# EAGLE design xkid_0.4 (EAGLE 7.1.0)
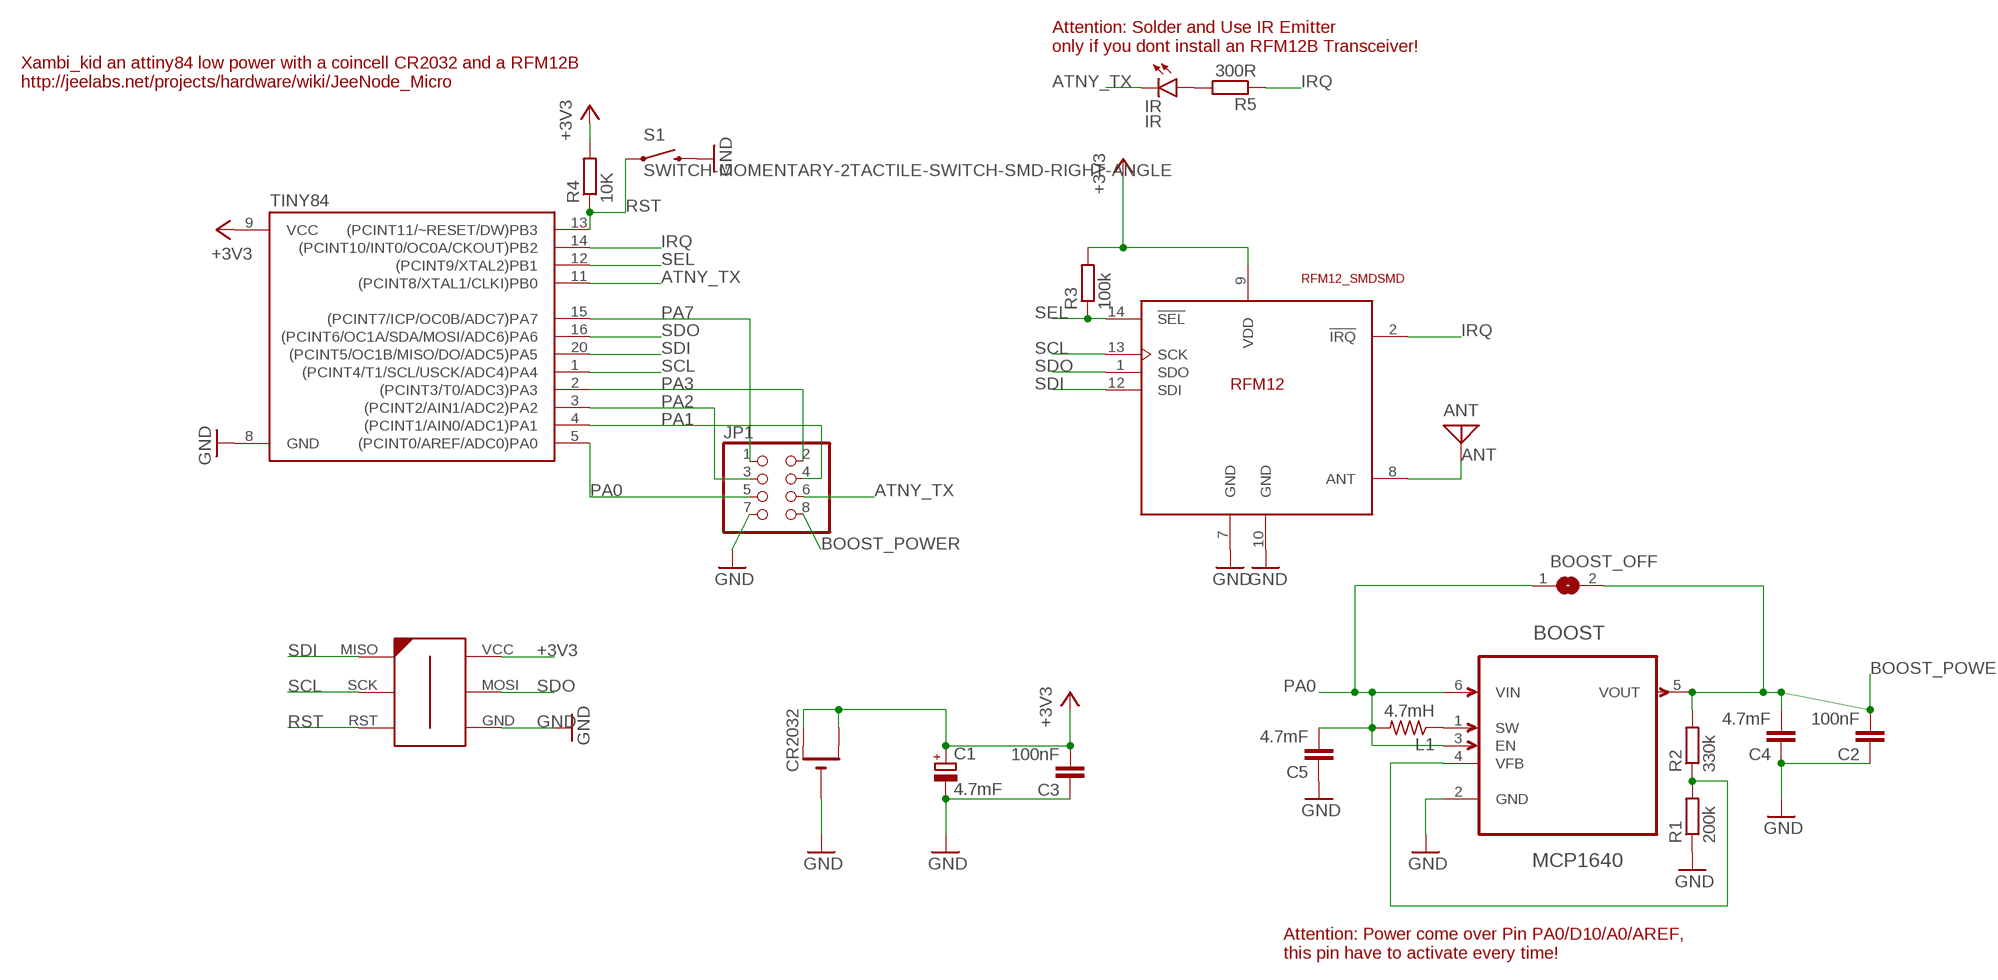
[diagram p0: schematic, sheet 1]

## Parts
ANT  ANTENNA  [PAD-01]
BOOST  MCP1640  MCP1640BT-I/CHY  [SOT95P270X145-6N]
BOOST_OFF  SJ  [SJ]
C1  4.7mF  CPOL-EUCT3216  [CT3216]
C2  100nF  C-EUC0805K  [C0805K]
C3  100nF  C-EUC0805K  [C0805K]
C4  4.7mF  C-EUC0805K  [C0805K]
C5  4.7mF  C-EUC0805K  [C0805K]
CR2032  CR2032SMT  [CR2032-SMD]
IR  IR  LED3MM  [LED3MM]
JP1  PINHD-2X4_2.54  [2X04]
L1  4.7mH  R-US_0204/5  [0204/5]
R1  200k  R-EU_R0805  [R0805]
R2  330k  R-EU_R0805  [R0805]
R3  100k  R-EU_R0805  [R0805]
R4  10K  R-EU_R0805  [R0805]
R5  300R  R-EU_R0805  [R0805]
S1  SWITCH-MOMENTARY-2TACTILE-SWITCH-SMD-RIGHT-ANGLE  [TACTILE_SWITCH-SMD-RIGHT-ANGLE]
TINY84  ATTINY84ATTINY84-20MU  [QFN20]
U$1  RFM12_SMDSMD  [RFM12]
U$2  AVR-ISP-6-EDGE  [6PAD_ISP]

## Nets
+3V3: C1.+ C3.2 CR2032.+$1(+) CR2032.+$2(+1) R3.2 R4.2 TINY84.9(VCC) U$1.9(VDD) U$2.VCC
ANT: ANT.1 U$1.8(ANT)
ATNY_TX: IR.K(C) JP1.6 TINY84.11((PCINT8/XTAL1/CLKI)PB0)
BOOST_POWER: BOOST.5(VOUT) BOOST_OFF.2 C2.2 C4.2 JP1.8 R2.2
GND: BOOST.2(GND) C1.- C2.1 C3.1 C4.1 C5.1 CR2032.- JP1.7 R1.1 S1.2 TINY84.8(GND) U$1.7(GND) U$1.10(GND) U$2.GND
IRQ: R5.1 TINY84.14((PCINT10/INT0/OC0A/CKOUT)PB2) U$1.2(!IRQ)
N$1: IR.A R5.2
N$2: BOOST.1(SW) L1.1
N$4: BOOST.4(VFB) R1.2 R2.1
PA0: BOOST.3(EN) BOOST.6(VIN) BOOST_OFF.1 C5.2 JP1.5 L1.2 TINY84.5((PCINT0/AREF/ADC0)PA0)
PA1: JP1.4 TINY84.4((PCINT1/AIN0/ADC1)PA1)
PA2: JP1.3 TINY84.3((PCINT2/AIN1/ADC2)PA2)
PA3: JP1.2 TINY84.2((PCINT3/T0/ADC3)PA3)
PA7: JP1.1 TINY84.15((PCINT7/ICP/OC0B/ADC7)PA7)
RST: R4.1 S1.1 TINY84.13((PCINT11/~RESET/DW)PB3) U$2.RST
SCL: TINY84.1((PCINT4/T1/SCL/USCK/ADC4)PA4) U$1.13(SCK) U$2.SCK
SDI: TINY84.20((PCINT5/OC1B/MISO/DO/ADC5)PA5) U$1.12(SDI) U$2.MISO
SDO: TINY84.16((PCINT6/OC1A/SDA/MOSI/ADC6)PA6) U$1.1(SDO) U$2.MOSI
SEL: R3.1 TINY84.12((PCINT9/XTAL2)PB1) U$1.14(!SEL)

## Notes on the sheet
- Attention: Solder and Use IR Emitter 
  only if you dont install an RFM12B Transceiver!
- Xambi_kid an attiny84 low power with a coincell CR2032 and a RFM12B
  http://jeelabs.net/projects/hardware/wiki/JeeNode_Micro
- Attention: Power come over Pin PA0/D10/A0/AREF,
  this pin have to activate every time!

## Library data of the parts
ANT = discrete:ANTENNA: Antenna
BOOST = xpix:MCP1640BT-I/CHY: Synchronous Boost Regulator; MPN: MCP1640BT-I/CHY; OC_FARNELL: 1800207; OC_NEWARK: 73R3625; PACKAGE: SOT-6; SUPPLIER: Microchip
BOOST_OFF = jumper:SJ: SMD solder JUMPER
C1 = rcl:CPOL-EU: POLARIZED CAPACITOR, European symbol
C2-C5 = rcl:C-EU: CAPACITOR, European symbol
CR2032 = adafruit:CR2032
IR = SparkFun-LED:LED: LEDs Standard schematic elements and footprints for 5mm, 3mm, 1206, and 0603 sized LEDs. 5mm - Spark Fun Electronics SKU : COM-00529 (and others)
JP1 = pinhead:PINHD-2X4: PIN HEADER
L1 = _adafruit:R-US_: RESISTOR, American symbol
R1-R5 = rcl:R-EU_: RESISTOR, European symbol
S1 = SparkFun-Electromechanical:SWITCH-MOMENTARY-2: Various NO switches- pushbuttons, reed, etc; PROD_ID: COMP-12265
TINY84 = SparkFun-DigitalIC:ATTINY84: Atmel 14-pin 2/4/8kB flash uC
U$1 = rfm_12:RFM12_SMD: RFM12 is a low costing ISM band transceiver module implemented with unique PLL. It works signal ranges from 315/433/868/915MHZ bands, comply with FCC, ETSI regulation. The SPI interface is used to communicate with microcontroller for parameter setting.
U$2 = avr-7:AVR-ISP-6-EDGE: 6 pin edge connector for ISP with ATMEL MCUs. Developed by Craig Moates (craig at moates dot net). Library by David Blundell (blundar at gmail dot com). Often, even a 6 pin header is really inconvenient for board layout and/or production. This SMD-only header is our de-facto standard for using an edge connector for programming with the help of a 6pin/10pin to edge card adapter.

## Board
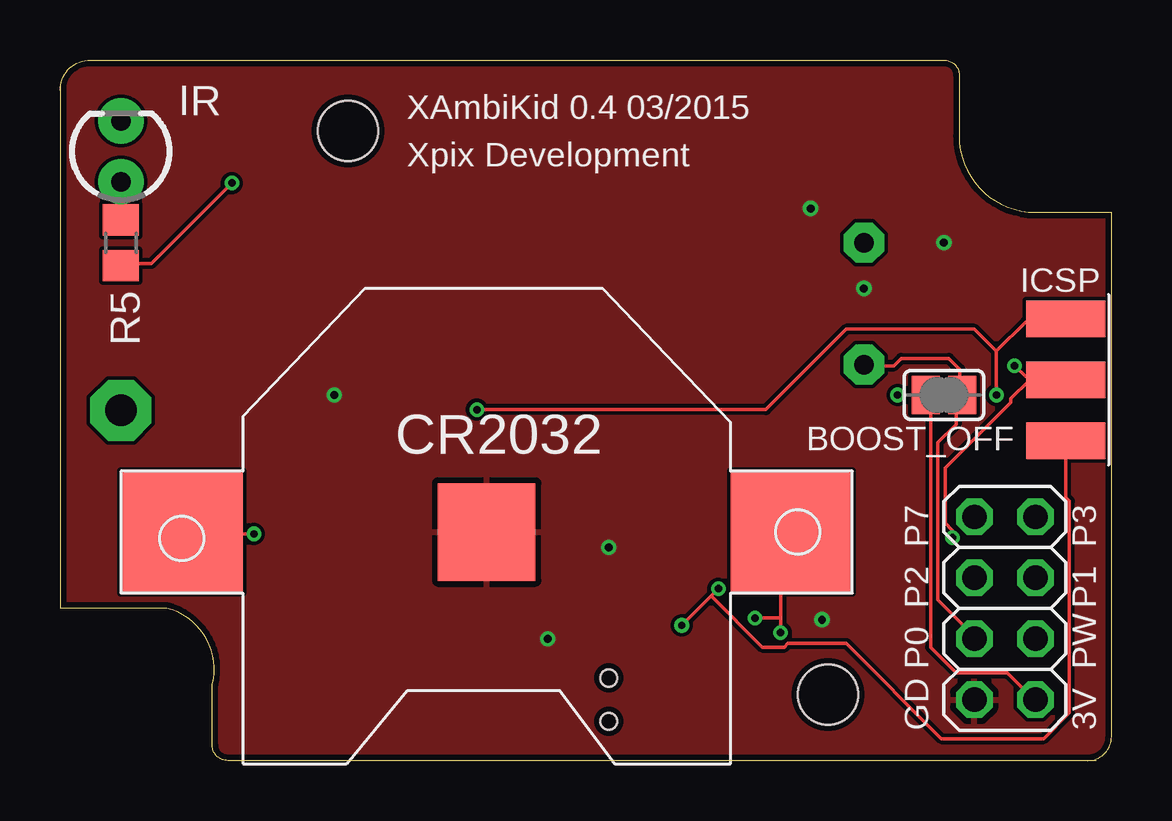
[diagram p1: board, top side]
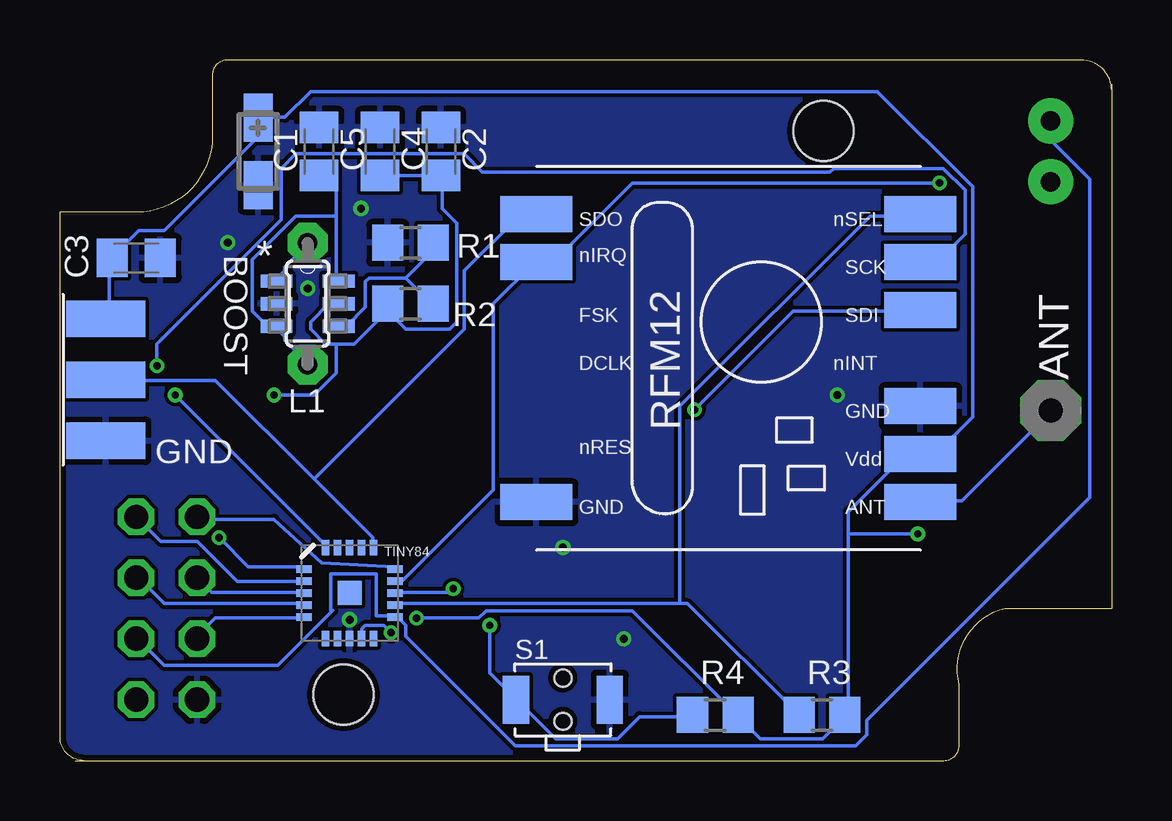
[diagram p2: board, bottom side, seen from below]

Size 43.81 x 29.21 mm. Coordinates in mm from the lower left corner, seen from the top.
Outline: 42.81,0 arc90 43.81,1 43.81,22.86 40.64,22.86 arc-90 37.47,26.04 37.47,28.57 arc90 36.83,29.21 1.27,29.21 arc90 0,27.94
Outline: 0,28.21 0,6.35 4.45,6.35 arc-90 6.35,3.17 6.35,0.64 arc90 6.99,0 43.18,0
Copper layers (1*16): Top 0.035mm / dielectric 1.5mm / Bottom 0.035mm
Design rules "ITEADstudio_DRC": minimum track width 6mil, minimum drill 12mil, track to track 6mil, track to pad 6mil, pad to pad 6mil, via to via 6mil, smd to smd 0mil, copper to edge 10mil, drill to drill 10mil, minimum pad ring 10mil, minimum via ring 6mil, stop-mask expansion 2mil, vias tented up to drill 100mil, thermal gap 10mil
Holes 2.5 mm at 32,2.75 12,26.25

### Footprints (pad centres in the part's own frame; a part is rotated, then mirrored left to right if it is on the bottom)
PAD-01 = drill 1.321 pad 2.54 octagon: 1 0,0
SOT95P270X145-6N = smd 1.321 x 0.559: 1 -1.295,0.94; 2 -1.295,0; 3 -1.295,-0.94; 4 1.295,-0.94; 5 1.295,0; 6 1.295,0.94
SJ = smd 1.168 x 1.6: 1 -0.762,0; 2 0.762,0
CT3216 = smd 2 x 1.2: + -1.4,0; - 1.4,0
C0805K = smd 1.3 x 1.6: 1 -1,0; 2 1,0
CR2032-SMD = smd 5.08 x 5.08: +$1 -12.7,0; +$2 12.7,0 | smd 4.064 x 4.064: - 0,0
LED3MM = drill 0.813 pad 1.88: A -1.27,0; K 1.27,0
2X04 = drill 1.016 octagon: 1 -3.81,-1.27; 2 -3.81,1.27; 3 -1.27,-1.27; 4 -1.27,1.27; 5 1.27,-1.27; 6 1.27,1.27; 7 3.81,-1.27; 8 3.81,1.27
0204/5 = drill 0.813 pad 1.676 octagon: 1 -2.54,0; 2 2.54,0
R0805 = smd 1.3 x 1.5: 1 -0.95,0; 2 0.95,0
TACTILE_SWITCH-SMD-RIGHT-ANGLE = smd 1.1 x 2: 1 -1.95,0; 2 1.95,0 | hole 0.7: 0,0.9; 0,-0.9
QFN20 = smd 1 x 1: 0 0,0 | smd 0.65 x 0.3: 1 -1.9,1; 2 -1.9,0.5; 3 -1.9,0; 4 -1.9,-0.5; 5 -1.9,-1; 11 1.9,-1; 12 1.9,-0.5; 13 1.9,0; 14 1.9,0.5; 15 1.9,1 | smd 0.3 x 0.65: 6 -1,-1.9; 7 -0.5,-1.9; 8 0,-1.9; 9 0.5,-1.9; 10 1,-1.9; 16 1,1.9; 17 0.5,1.9; 18 0,1.9; 19 -0.5,1.9; 20 -1,1.9
RFM12 = smd 1.5 x 3: 1 -5,-10; 2 -3,-10; 7 7,-10; 8 7,6; 9 5,6; 10 3,6; 12 -1,6; 13 -3,6; 14 -5,6
6PAD_ISP = smd 1.524 x 3.302 bottom: GND 2.54,0; MOSI 0,0; VCC -2.54,0 | smd 1.524 x 3.302: MISO -2.54,0; RST 2.54,0; SCK 0,0

### Placement (x,y rotation side)
ANT  2.54,14.61 270 bottom
BOOST  33.5,19.05 0 bottom
BOOST_OFF  36.83,15.24 180 top
C1  35.56,25.4 270 bottom
C2  27.94,25.4 270 bottom
C3  40.64,20.95 180 bottom
C4  30.48,25.4 270 bottom
C5  33.02,25.4 270 bottom
CR2032  17.78,9.53 180 top
IR  2.54,25.4 90 top
JP1  39.37,6.35 270 top
L1  33.5,19.05 270 bottom
R1  29.21,21.59 0 bottom
R2  29.21,19.05 180 bottom
R3  12.06,1.91 0 bottom
R4  16.51,1.91 0 bottom
R5  2.54,21.59 90 top
S1  22.86,2.54 0 bottom
TINY84  31.75,6.99 0 bottom
U$1  13.97,17.78 270 bottom
U$2  41.91,15.88 270 top

### Tracks (layer width: path | path; a pad name or v marks a point on that pad's centre or on a via)
+3V3  (via drill 0.3)
  Top 0.152: 30.02,5.94 30.02,8.99 30.48,9.45 CR2032.+$1 | 30.02,5.94 v30.02,5.33 | v8.08,9.45 5.18,9.45 CR2032.+$2 | v28.96,5.94 30.02,5.94
  Bottom 0.152: U$2.VCC 41.91,18.44 41.76,18.59 41.76,20.88 C3.2 41.6,21.03 40.54,22.1 39.47,22.1 35.66,25.91 35.66,26.67 C1.+ 35.51,26.82 34.44,26.82 33.38,27.89 9.75,27.89 5.79,23.93 5.79,14.33 7.32,12.8 7.92,12.8 U$1.9 8.08,12.65 8.69,12.65 10.97,10.36 10.97,9.45 | v30.02,5.33 30.33,5.64 31.09,5.64 31.24,5.49 31.24,5.18 TINY84.9 | 10.97,9.45 10.97,1.98 R3.2 11.12,1.83 12.04,0.91 14.63,0.91 15.54,1.83 R4.2 15.7,1.98 19.96,6.25 26.06,6.25 26.36,5.94 v28.96,5.94 | 10.97,9.45 v8.08,9.45
ANT
  Bottom 0.152: U$1.8 7.92,10.82 6.25,10.82 2.59,14.48 ANT.1
ATNY_TX
  Bottom 0.152: 29.87,5.94 TINY84.11 | JP1.6 40.54,5.03 39.47,3.96 34.75,3.96 32.45,6.26 32.54,6.26 32.54,7.78 30.64,7.78 30.64,6.03 29.85,6.03 TINY84.11 | IR.K 2.44,26.67 2.44,25.76 0.91,24.23 0.91,10.97 10.21,1.68 10.21,1.07 10.67,0.61 24.84,0.61 29.41,5.18 29.41,5.64 29.72,5.94 TINY84.11
BOOST_POWER  (via drill 0.3)
  Top 0.152: v34.9,15.24 BOOST_OFF.2 36.12,15.24 36.27,15.09 36.27,4.72 37.34,3.66 39.47,3.66 40.54,2.59 JP1.8
  Bottom 0.152: C4.2 30.48,24.38 28.04,24.38 C2.2 27.89,24.38 27.89,23.01 27.28,22.4 27.28,18.29 27.58,17.98 29.41,17.98 30.18,18.75 | BOOST.5 32.61,19.05 33.38,18.29 33.38,17.98 32.77,17.37 32.31,17.37 | 32.31,17.37 31.55,17.37 30.18,18.75 | 30.18,18.75 30.18,19.05 R2.2 30.18,18.75 | v34.9,15.24 33.22,15.24 32.31,16.15 32.31,17.37
GND  (via drill 0.33)
  other vias: 11.43,15.24 22.86,8.89 20.32,5.08 36.83,21.59 33.5,19.68 31.27,23.02 31.75,5.87
  pour Bottom: 0,0 0,29.21 44.45,29.21 44.45,0
  pour Top: 0,0 0,29.21 44.45,29.21 44.45,0
IRQ  (via drill 0.3)
  Top 0.152: v7.16,24.08 3.81,20.73 2.59,20.73 R5.1
  Bottom 0.152: TINY84.14 29.72,7.47 29.57,7.47 25.76,11.28 25.76,19.05 24.08,20.73 U$1.2 23.93,20.88 23.16,20.88 19.96,24.08 v7.16,24.08
N$1
  Top 0.152: R5.2 2.59,22.55 2.59,24.08 IR.A
N$2
  Bottom 0.152: BOOST.1 34.75,20.12 34.44,20.42 34.44,20.57 33.53,21.49 L1.1
N$4
  Bottom 0.152: 29.41,20.12 30.94,20.12 31.09,19.96 31.09,18.9 31.85,18.14 32.16,18.14 BOOST.4 | 29.41,20.12 28.35,19.05 R2.1 | 29.41,20.12 28.35,21.18 28.35,21.49 R1.2
PA0
  Top 0.152: 37.49,15.24 37.49,16.31 37.03,16.76 35.05,16.76 34.75,16.46 33.53,16.46 L1.2 | 37.49,15.24 37.34,15.09 37.34,14.02 36.58,13.26 36.58,6.71 38.1,5.18 JP1.5 | 37.49,15.24 BOOST_OFF.1
  Bottom 0.152: TINY84.5 33.68,5.94 37.34,5.94 38.1,5.18 JP1.5 | 32.31,22.71 32.31,23.77 32.92,24.38 C5.2 | 32.31,22.71 32.31,20.12 BOOST.6 | L1.2 33.53,16.61 34.44,17.53 34.44,17.68 34.75,17.98 BOOST.3 34.9,18.14 35.2,18.14 35.81,18.75 35.81,20.88 33.98,22.71 32.31,22.71
PA1
  Bottom 0.152: TINY84.4 33.68,6.55 39.47,6.55 40.54,7.62 JP1.4
PA2
  Bottom 0.152: JP1.3 37.49,7.01 33.68,7.01 TINY84.3
PA3
  Bottom 0.152: JP1.2 39.62,9.14 38.1,9.14 36.42,7.47 33.68,7.47 TINY84.2
PA7
  Bottom 0.152: TINY84.15 29.87,8.08 32.92,8.24 34.9,10.06 38.1,10.06 JP1.1
RST  (via drill 0.3)
  Top 0.152: v25.91,5.64 27.13,6.86 | 27.13,6.86 v27.43,7.16 | U$2.RST 41.91,10.97 42.06,10.82 42.06,1.98 41,0.91 36.73,0.91 32.77,4.88 30.33,4.88 30.18,4.72 29.26,4.72 27.13,6.86
  Bottom 0.152: v27.43,7.16 27.58,7.01 29.72,7.01 TINY84.13 | v25.91,5.64 25.91,3.66 24.84,2.59 S1.1 24.69,2.44 23.16,0.91 20.57,0.91 19.66,1.83 17.53,1.83 R4.1
SCL  (via drill 0.3)
  Top 0.152: v37.19,9.3 37.19,9.6 36.88,9.91 36.88,12.19 39.62,14.94 39.62,15.09 40.39,15.85 40.54,15.85 | 40.54,15.85 41.91,15.85 U$2.SCK 40.54,15.85 | v39.78,16.46 40.23,16 40.39,16 40.54,15.85
  Bottom 0.152: v37.19,9.3 35.97,8.08 33.68,8.08 TINY84.1 | v39.78,16.46 39.78,17.37 34.59,22.55 34.59,24.69 33.98,25.3 26.98,25.3 26.21,24.54 11.73,24.54 11.58,24.69 7.01,24.69 6.1,23.77 6.1,21.95 7.16,20.88 7.92,20.88 U$1.13
SDI  (via drill 0.3)
  Top 0.152: 39.01,17.07 v39.01,15.24 | 39.01,17.07 40.23,18.29 41.91,18.29 U$2.MISO | v17.37,14.63 29.41,14.63 32.77,17.98 38.1,17.98 39.01,17.07
  Bottom 0.152: v39.01,15.24 32.77,8.99 TINY84.20 | v17.37,14.63 13.26,18.75 8.08,18.75 U$1.12
SDO
  Bottom 0.152: 33.22,11.73 37.34,15.85 41.91,15.85 U$2.MOSI | 33.22,11.73 30.79,9.3 30.79,8.99 TINY84.16 | 33.22,11.73 26.98,17.98 26.98,20.42 24.69,22.71 24.08,22.71 U$1.1
SEL
  Bottom 0.152: 17.98,6.55 17.68,6.55 13.11,1.98 R3.1 | 17.98,6.55 29.72,6.55 TINY84.12 | 17.98,6.55 17.98,14.78 10.06,22.71 8.08,22.71 U$1.14

### Text on the board
tNames: XAmbiKid 0.4 03/2015 / Xpix Development | ICSP | P7 | P3 | P2 | P1 | P0 | PW | GD | 3V
bNames: GND